# Altium schematic sheet RK3399_Power_Pins.SchDoc
size A3; SheetNumber: 5; SheetTotal: 20
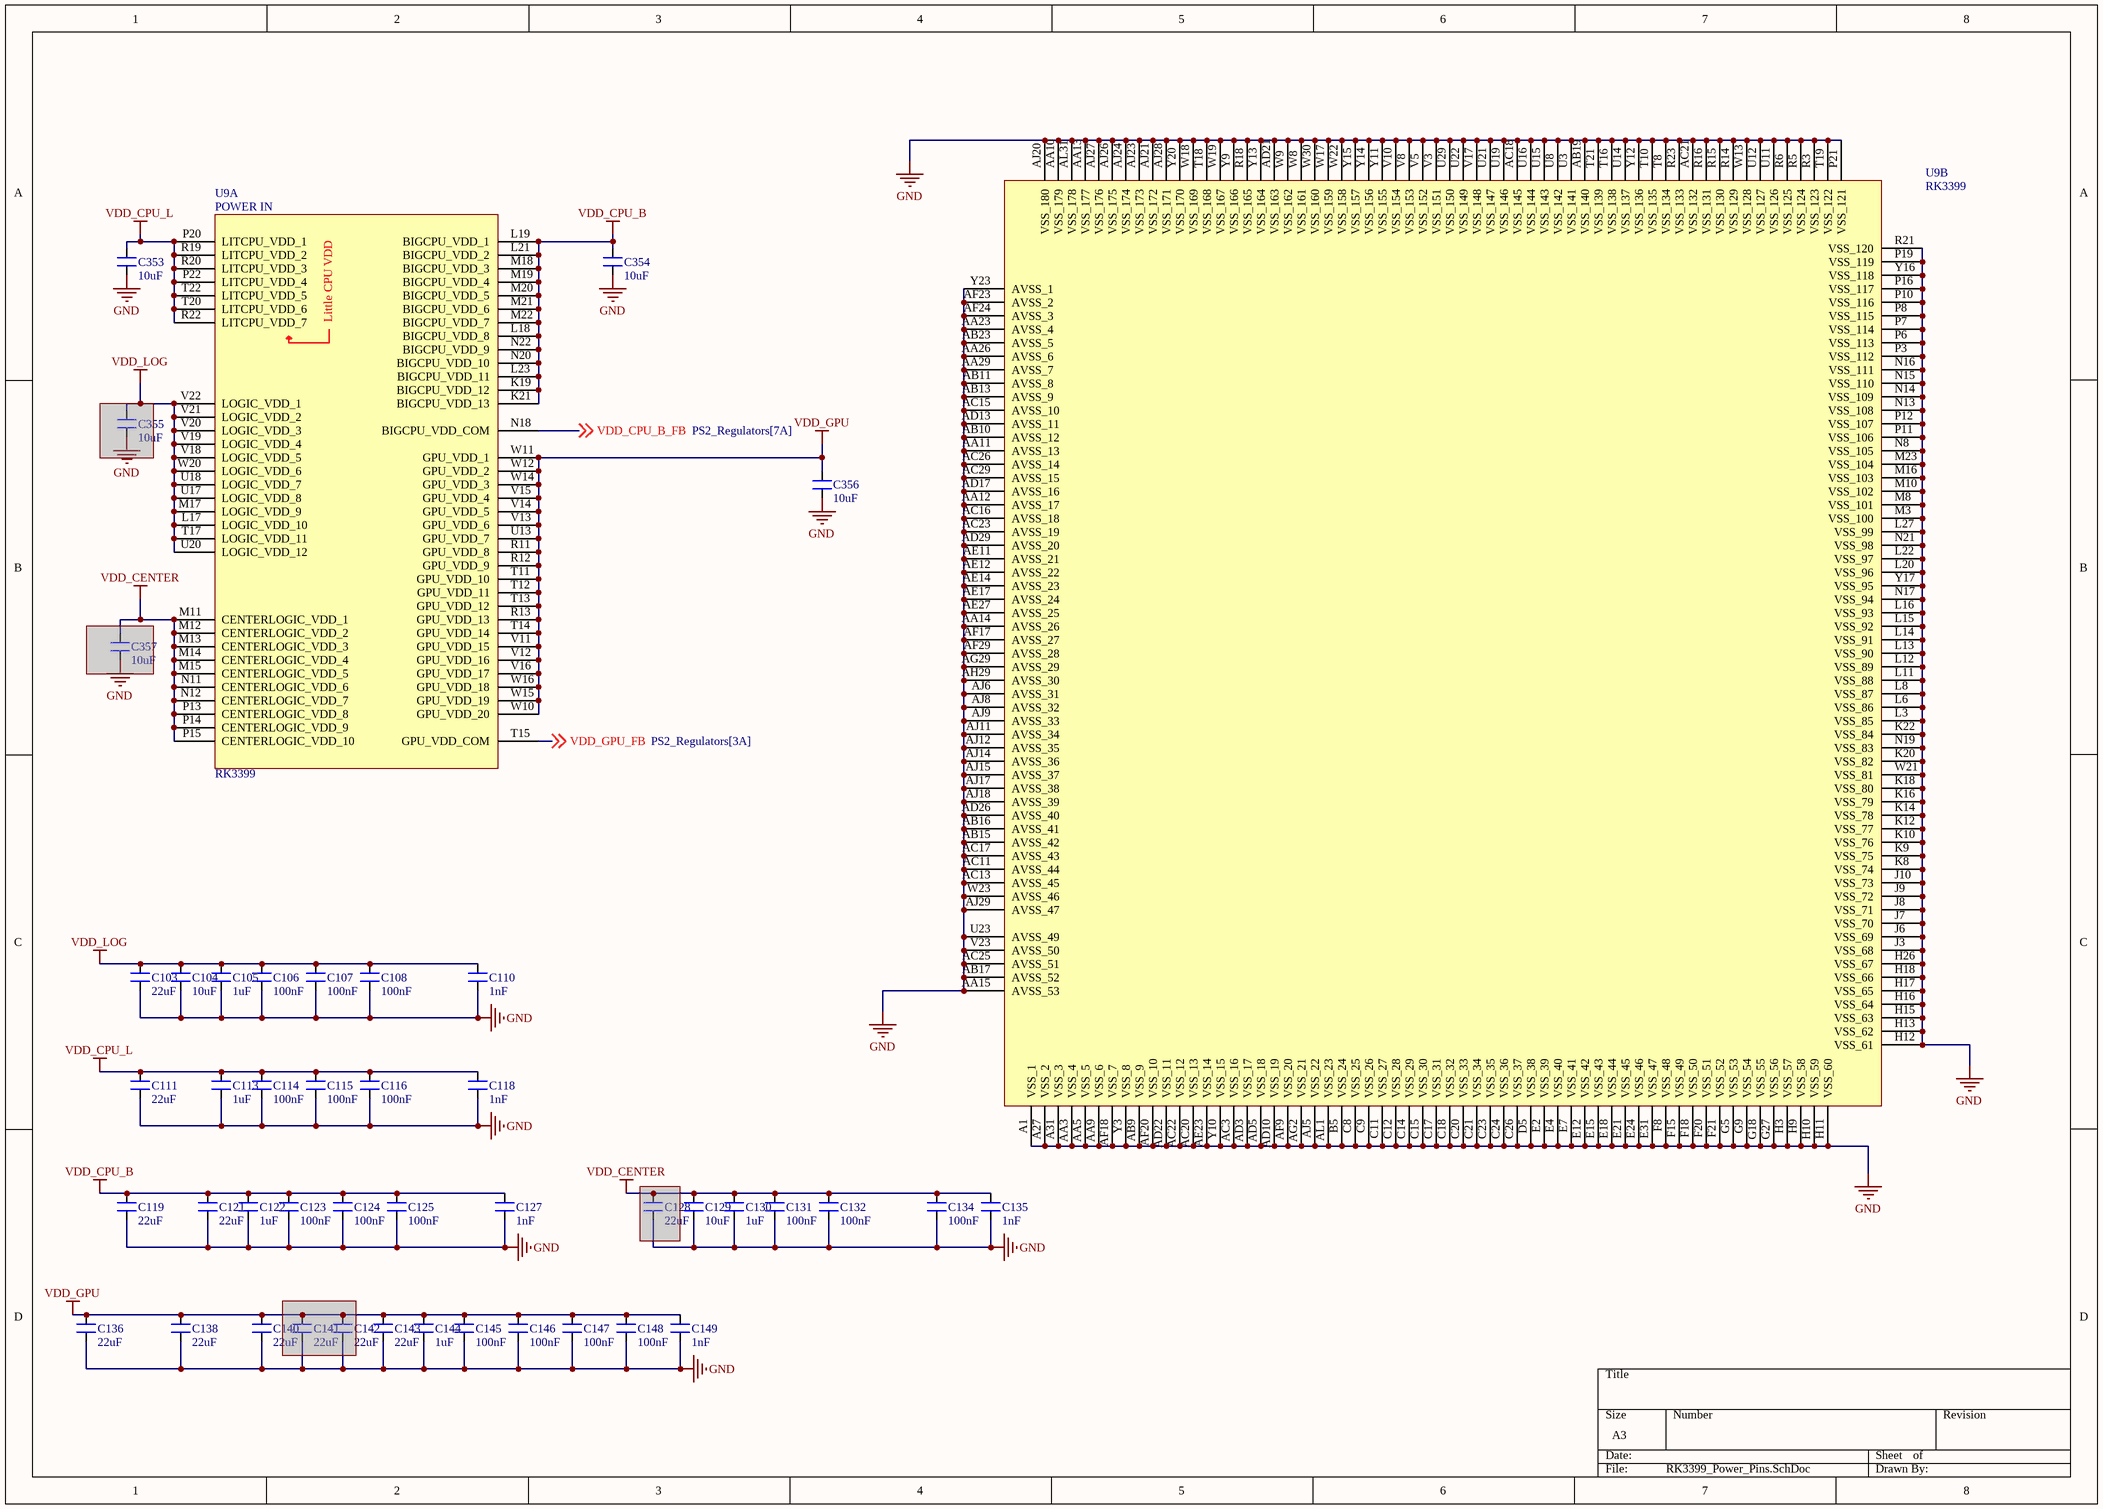
[diagram p0: RK3399_Power_Pins.SchDoc]

## Parts
C103  22uF  [CAP_0603]
C104  10uF  [CAP_0603]
C105  1uF  [CAP_0201]
C106  100nF  [CAP_0201]
C107  100nF  [CAP_0201]
C108  100nF  [CAP_0201]
C110  1nF  [CAP_0201]
C111  22uF  [CAP_0603]
C113  1uF  [CAP_0201]
C114  100nF  [CAP_0201]
C115  100nF  [CAP_0201]
C116  100nF  [CAP_0201]
C118  1nF  [CAP_0201]
C119  22uF  [CAP_0603]
C121  22uF  [CAP_0603]
C122  1uF  [CAP_0201]
C123  100nF  [CAP_0201]
C124  100nF  [CAP_0201]
C125  100nF  [CAP_0201]
C127  1nF  [CAP_0201]
C128  22uF  [CAP_0603]  (masked out: inside a compile mask, not in the netlist)
C129  10uF  [CAP_0603]
C130  1uF  [CAP_0201]
C131  100nF  [CAP_0201]
C132  100nF  [CAP_0201]
C134  100nF  [CAP_0201]
C135  1nF  [CAP_0201]
C136  22uF  [CAP_0603]
C138  22uF  [CAP_0603]
C140  22uF  [CAP_0603]
C141  22uF  [CAP_0603]  (masked out: inside a compile mask, not in the netlist)
C142  22uF  [CAP_0603]  (masked out: inside a compile mask, not in the netlist)
C143  22uF  [CAP_0603]
C144  1uF  [CAP_0201]
C145  100nF  [CAP_0201]
C146  100nF  [CAP_0201]
C147  100nF  [CAP_0201]
C148  100nF  [CAP_0201]
C149  1nF  [CAP_0201]
C353  10uF  [CAP_0603]
C354  10uF  [CAP_0603]
C355  10uF  [CAP_0603]  (masked out: inside a compile mask, not in the netlist)
C356  10uF  [CAP_0603]
C357  10uF  [CAP_0603]  (masked out: inside a compile mask, not in the netlist)
U9  RK3399  [FBGA828_23_826X826]  (parts A,B of 24)

## Nets
GND: C103.1 C104.1 C105.1 C106.2 C107.2 C108.2 C110.1 C111.1 C113.1 C114.2 C115.2 C116.2 C118.1 C119.1 C121.1 C122.1 C123.2 C124.2 C125.2 C127.1 C129.1 C130.1 C131.2 C132.2 C134.2 C135.1 C136.1 C138.1 C140.1 C143.1 C144.1 C145.2 C146.2 C147.2 C148.2 C149.1 C353.1 C354.1 C356.1 U9.A1(VSS_1) U9.A27(VSS_2) U9.A31(VSS_3) U9.AA3(VSS_4) U9.AA5(VSS_5) U9.AA9(VSS_6) U9.AA10(VSS_179) U9.AA11(AVSS_13) U9.AA12(AVSS_17) U9.AA13(VSS_177) U9.AA14(AVSS_26) U9.AA15(AVSS_53) U9.AA23(AVSS_4) U9.AA26(AVSS_6) U9.AA29(AVSS_7) U9.AB9(VSS_9) U9.AB10(AVSS_12) U9.AB11(AVSS_8) U9.AB13(AVSS_9) U9.AB15(AVSS_42) U9.AB16(AVSS_41) U9.AB17(AVSS_52) U9.AB19(VSS_140) U9.AB23(AVSS_5) U9.AC3(VSS_16) U9.AC11(AVSS_44) U9.AC13(AVSS_45) U9.AC15(AVSS_10) U9.AC16(AVSS_18) U9.AC17(AVSS_43) U9.AC18(VSS_145) U9.AC20(VSS_13) U9.AC21(VSS_132) U9.AC22(VSS_12) U9.AC23(AVSS_19) U9.AC25(AVSS_51) U9.AC26(AVSS_14) U9.AC29(AVSS_15) U9.AD3(VSS_17) U9.AD5(VSS_18) U9.AD10(VSS_19) U9.AD13(AVSS_11) U9.AD17(AVSS_16) U9.AD21(VSS_163) U9.AD22(VSS_11) U9.AD26(AVSS_40) U9.AD29(AVSS_20) U9.AE11(AVSS_21) U9.AE12(AVSS_22) U9.AE14(AVSS_23) U9.AE17(AVSS_24) U9.AE23(VSS_14) U9.AE27(AVSS_25) U9.AF9(VSS_20) U9.AF17(AVSS_27) U9.AF18(VSS_7) U9.AF20(VSS_10) U9.AF23(AVSS_2) U9.AF24(AVSS_3) U9.AF29(AVSS_28) U9.AG2(VSS_21) U9.AG29(AVSS_29) U9.AH29(AVSS_30) U9.AJ5(VSS_22) U9.AJ6(AVSS_31) U9.AJ8(AVSS_32) U9.AJ9(AVSS_33) U9.AJ11(AVSS_34) U9.AJ12(AVSS_35) U9.AJ14(AVSS_36) U9.AJ15(AVSS_37) U9.AJ17(AVSS_38) U9.AJ18(AVSS_39) U9.AJ20(VSS_180) U9.AJ21(VSS_172) U9.AJ23(VSS_173) U9.AJ24(VSS_174) U9.AJ26(VSS_175) U9.AJ27(VSS_176) U9.AJ28(VSS_171) U9.AJ29(AVSS_47) U9.AL1(VSS_23) U9.AL31(VSS_178) U9.B5(VSS_24) U9.C8(VSS_25) U9.C9(VSS_26) U9.C11(VSS_27) U9.C12(VSS_28) U9.C14(VSS_29) U9.C15(VSS_30) U9.C17(VSS_31) U9.C18(VSS_32) U9.C20(VSS_33) U9.C21(VSS_34) U9.C23(VSS_35) U9.C24(VSS_36) U9.C26(VSS_37) U9.D5(VSS_38) U9.E2(VSS_39) U9.E4(VSS_40) U9.E7(VSS_41) U9.E12(VSS_42) U9.E15(VSS_43) U9.E18(VSS_44) U9.E21(VSS_45) U9.E24(VSS_46) U9.E31(VSS_47) U9.F8(VSS_48) U9.F15(VSS_49) U9.F18(VSS_50) U9.F20(VSS_51) U9.F21(VSS_52) U9.G5(VSS_53) U9.G9(VSS_54) U9.G18(VSS_55) U9.G27(VSS_56) U9.H3(VSS_57) U9.H9(VSS_58) U9.H10(VSS_59) U9.H11(VSS_60) U9.H12(VSS_61) U9.H13(VSS_62) U9.H15(VSS_63) U9.H16(VSS_64) U9.H17(VSS_65) U9.H18(VSS_66) U9.H26(VSS_67) U9.J3(VSS_68) U9.J6(VSS_69) U9.J7(VSS_70) U9.J8(VSS_71) U9.J9(VSS_72) U9.J10(VSS_73) U9.K8(VSS_74) U9.K9(VSS_75) U9.K10(VSS_76) U9.K12(VSS_77) U9.K14(VSS_78) U9.K16(VSS_79) U9.K18(VSS_80) U9.K20(VSS_82) U9.K22(VSS_84) U9.L3(VSS_85) U9.L6(VSS_86) U9.L8(VSS_87) U9.L11(VSS_88) U9.L12(VSS_89) U9.L13(VSS_90) U9.L14(VSS_91) U9.L15(VSS_92) U9.L16(VSS_93) U9.L20(VSS_96) U9.L22(VSS_97) U9.L27(VSS_99) U9.M3(VSS_100) U9.M8(VSS_101) U9.M10(VSS_102) U9.M16(VSS_103) U9.M23(VSS_104) U9.N8(VSS_105) U9.N13(VSS_108) U9.N14(VSS_109) U9.N15(VSS_110) U9.N16(VSS_111) U9.N17(VSS_94) U9.N19(VSS_83) U9.N21(VSS_98) U9.P3(VSS_112) U9.P6(VSS_113) U9.P7(VSS_114) U9.P8(VSS_115) U9.P10(VSS_116) U9.P11(VSS_106) U9.P12(VSS_107) U9.P16(VSS_117) U9.P19(VSS_119) U9.P21(VSS_121) U9.R3(VSS_123) U9.R5(VSS_124) U9.R6(VSS_125) U9.R14(VSS_129) U9.R15(VSS_130) U9.R16(VSS_131) U9.R18(VSS_165) U9.R21(VSS_120) U9.R23(VSS_133) U9.T8(VSS_134) U9.T10(VSS_135) U9.T16(VSS_138) U9.T18(VSS_168) U9.T19(VSS_122) U9.T21(VSS_139) U9.U3(VSS_141) U9.U8(VSS_142) U9.U11(VSS_126) U9.U12(VSS_127) U9.U14(VSS_137) U9.U15(VSS_143) U9.U16(VSS_144) U9.U19(VSS_146) U9.U21(VSS_147) U9.U22(VSS_149) U9.U23(AVSS_49) U9.U29(VSS_150) U9.V3(VSS_151) U9.V5(VSS_152) U9.V8(VSS_153) U9.V10(VSS_154) U9.V17(VSS_148) U9.V23(AVSS_50) U9.W8(VSS_161) U9.W9(VSS_162) U9.W13(VSS_128) U9.W17(VSS_159) U9.W18(VSS_169) U9.W19(VSS_167) U9.W21(VSS_81) U9.W22(VSS_158) U9.W23(AVSS_46) U9.W30(VSS_160) U9.Y3(VSS_8) U9.Y9(VSS_166) U9.Y10(VSS_15) U9.Y11(VSS_155) U9.Y12(VSS_136) U9.Y13(VSS_164) U9.Y14(VSS_156) U9.Y15(VSS_157) U9.Y16(VSS_118) U9.Y17(VSS_95) U9.Y20(VSS_170) U9.Y23(AVSS_1)
VDD_CENTER: C129.2 C130.2 C131.1 C132.1 C134.1 C135.2 U9.M11(CENTERLOGIC_VDD_1) U9.M12(CENTERLOGIC_VDD_2) U9.M13(CENTERLOGIC_VDD_3) U9.M14(CENTERLOGIC_VDD_4) U9.M15(CENTERLOGIC_VDD_5) U9.N11(CENTERLOGIC_VDD_6) U9.N12(CENTERLOGIC_VDD_7) U9.P13(CENTERLOGIC_VDD_8) U9.P14(CENTERLOGIC_VDD_9) U9.P15(CENTERLOGIC_VDD_10)
VDD_CPU_B: C119.2 C121.2 C122.2 C123.1 C124.1 C125.1 C127.2 C354.2 U9.K19(BIGCPU_VDD_12) U9.K21(BIGCPU_VDD_13) U9.L18(BIGCPU_VDD_8) U9.L19(BIGCPU_VDD_1) U9.L21(BIGCPU_VDD_2) U9.L23(BIGCPU_VDD_11) U9.M18(BIGCPU_VDD_3) U9.M19(BIGCPU_VDD_4) U9.M20(BIGCPU_VDD_5) U9.M21(BIGCPU_VDD_6) U9.M22(BIGCPU_VDD_7) U9.N20(BIGCPU_VDD_10) U9.N22(BIGCPU_VDD_9)
VDD_CPU_L: C111.2 C113.2 C114.1 C115.1 C116.1 C118.2 C353.2 U9.P20(LITCPU_VDD_1) U9.P22(LITCPU_VDD_4) U9.R19(LITCPU_VDD_2) U9.R20(LITCPU_VDD_3) U9.R22(LITCPU_VDD_7) U9.T20(LITCPU_VDD_6) U9.T22(LITCPU_VDD_5)
VDD_GPU: C136.2 C138.2 C140.2 C143.2 C144.2 C145.1 C146.1 C147.1 C148.1 C149.2 C356.2 U9.R11(GPU_VDD_8) U9.R12(GPU_VDD_9) U9.R13(GPU_VDD_13) U9.T11(GPU_VDD_10) U9.T12(GPU_VDD_11) U9.T13(GPU_VDD_12) U9.T14(GPU_VDD_14) U9.U13(GPU_VDD_7) U9.V11(GPU_VDD_15) U9.V12(GPU_VDD_16) U9.V13(GPU_VDD_6) U9.V14(GPU_VDD_5) U9.V15(GPU_VDD_4) U9.V16(GPU_VDD_17) U9.W10(GPU_VDD_20) U9.W11(GPU_VDD_1) U9.W12(GPU_VDD_2) U9.W14(GPU_VDD_3) U9.W15(GPU_VDD_19) U9.W16(GPU_VDD_18)
VDD_LOG: C103.2 C104.2 C105.2 C106.1 C107.1 C108.1 C110.2 U9.L17(LOGIC_VDD_10) U9.M17(LOGIC_VDD_9) U9.T17(LOGIC_VDD_11) U9.U17(LOGIC_VDD_8) U9.U18(LOGIC_VDD_7) U9.U20(LOGIC_VDD_12) U9.V18(LOGIC_VDD_5) U9.V19(LOGIC_VDD_4) U9.V20(LOGIC_VDD_3) U9.V21(LOGIC_VDD_2) U9.V22(LOGIC_VDD_1) U9.W20(LOGIC_VDD_6)
VDD_CPU_B_FB: U9.N18(BIGCPU_VDD_COM) ; off-sheet VDD_CPU_B_FB
VDD_GPU_FB: U9.T15(GPU_VDD_COM) ; off-sheet VDD_GPU_FB

## Notes on the sheet
- (in symbol IC_RK3399-FCBGA828, part A) POWER IN; Little CPU VDD

## Library data of the parts
C103 C111 C119 C121 C128 C136 C138 C140-C143 = CAP_22uF-10V-20%-0603: 22µF ±20% 10V Ceramic Capacitor X5R 0603 (1608 Metric); Manufacturer: Murata Electronics; Manufacturer Part Number: GRM188R61A226ME15D; Case/Package: 0603; Supplier-1: Digikey
C104 C129 C353-C357 = CAP_10uF-10V-10%-0603: 10µF ±10% 10V Ceramic Capacitor X5R 0603 (1608 Metric); Manufacturer Part Number: GRM188R61A106KE69J; Manufacturer: Murata Electronics; Case/Package: 0603; Supplier-1: Digikey
C105 C113 C122 C130 C144 = CAP_1uF-16V-10%-0201: 1µF ±20% 16V Ceramic Capacitor X5R 0201 (0603 Metric); Manufacturer: Samsung Electro-Mechanics; Manufacturer Part Number: CL03A105MO3NRNH; Case/Package: 0201; Supplier-1: Digikey
C106-C108 C114-C116 C123-C125 C131 C132 C134 C145-C148 = CAP_100nF-25V-10%-0201: 0.1µF ±10% 25V Ceramic Capacitor X5R 0201 (0603 Metric); Manufacturer: TDK Corporation; Manufacturer Part Number: C0603X5R1E104K030BB; Case/Package: 0201; Supplier-1: Digikey
C110 C118 C127 C135 C149 = CAP_1nF-16V-10%-0201: 1000pF ±10% 16V Ceramic Capacitor X7R 0201 (0603 Metric); Manufacturer: Murata Electronics; Manufacturer Part Number: GRM033R71C102KA01D; Case/Package: 0201; Supplier-1: Digikey
U9 = IC_RK3399-FCBGA828: RK3399 is a low power, high performance processor for computing, personal mobile.; Manufacturer: Rockchip; Manufacturer Part Number: RK3399; Case/Package: FCBGA828; Supplier-1: Rockchip